# EAGLE design 2pix (EAGLE 6.5.0)
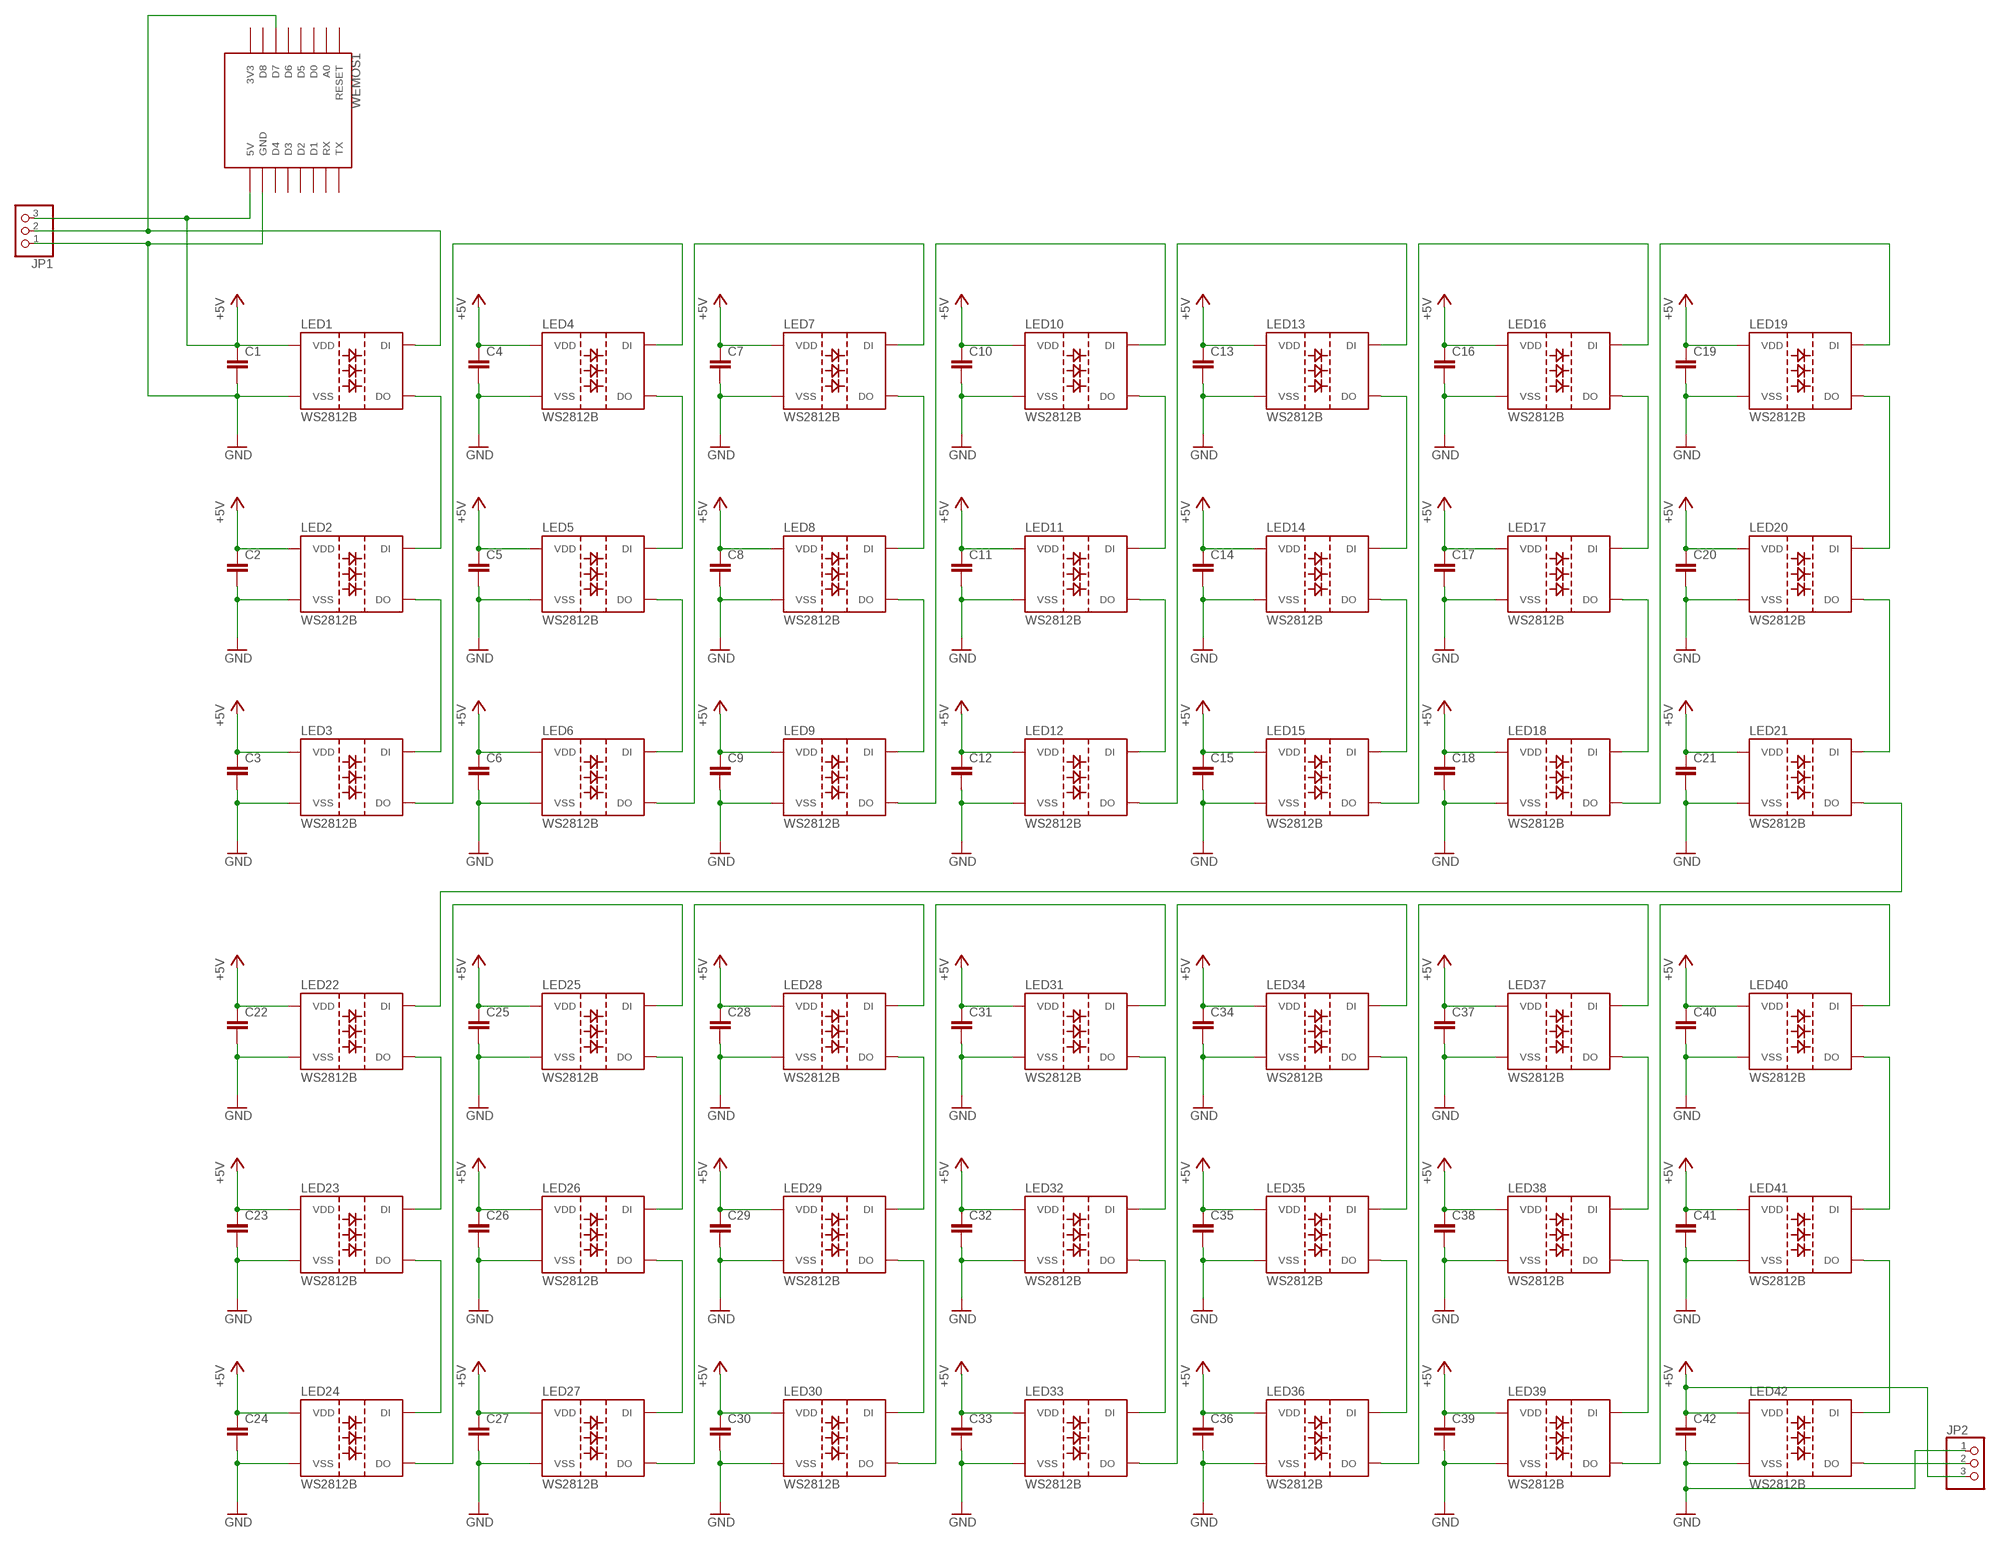
[diagram p0: schematic, sheet 1]

## Parts
C1  C-EUC1206  [C1206]
C2  C-EUC1206  [C1206]
C3  C-EUC1206  [C1206]
C4  C-EUC1206  [C1206]
C5  C-EUC1206  [C1206]
C6  C-EUC1206  [C1206]
C7  C-EUC1206  [C1206]
C8  C-EUC1206  [C1206]
C9  C-EUC1206  [C1206]
C10  C-EUC1206  [C1206]
C11  C-EUC1206  [C1206]
C12  C-EUC1206  [C1206]
C13  C-EUC1206  [C1206]
C14  C-EUC1206  [C1206]
C15  C-EUC1206  [C1206]
C16  C-EUC1206  [C1206]
C17  C-EUC1206  [C1206]
C18  C-EUC1206  [C1206]
C19  C-EUC1206  [C1206]
C20  C-EUC1206  [C1206]
C21  C-EUC1206  [C1206]
C22  C-EUC1206  [C1206]
C23  C-EUC1206  [C1206]
C24  C-EUC1206  [C1206]
C25  C-EUC1206  [C1206]
C26  C-EUC1206  [C1206]
C27  C-EUC1206  [C1206]
C28  C-EUC1206  [C1206]
C29  C-EUC1206  [C1206]
C30  C-EUC1206  [C1206]
C31  C-EUC1206  [C1206]
C32  C-EUC1206  [C1206]
C33  C-EUC1206  [C1206]
C34  C-EUC1206  [C1206]
C35  C-EUC1206  [C1206]
C36  C-EUC1206  [C1206]
C37  C-EUC1206  [C1206]
C38  C-EUC1206  [C1206]
C39  C-EUC1206  [C1206]
C40  C-EUC1206  [C1206]
C41  C-EUC1206  [C1206]
C42  C-EUC1206  [C1206]
JP1  PINHD-1X3  [1X03]
JP2  PINHD-1X3  [1X03]
LED1  WS2812B  [WS2812B]
LED2  WS2812B  [WS2812B]
LED3  WS2812B  [WS2812B]
LED4  WS2812B  [WS2812B]
LED5  WS2812B  [WS2812B]
LED6  WS2812B  [WS2812B]
LED7  WS2812B  [WS2812B]
LED8  WS2812B  [WS2812B]
LED9  WS2812B  [WS2812B]
LED10  WS2812B  [WS2812B]
LED11  WS2812B  [WS2812B]
LED12  WS2812B  [WS2812B]
LED13  WS2812B  [WS2812B]
LED14  WS2812B  [WS2812B]
LED15  WS2812B  [WS2812B]
LED16  WS2812B  [WS2812B]
LED17  WS2812B  [WS2812B]
LED18  WS2812B  [WS2812B]
LED19  WS2812B  [WS2812B]
LED20  WS2812B  [WS2812B]
LED21  WS2812B  [WS2812B]
LED22  WS2812B  [WS2812B]
LED23  WS2812B  [WS2812B]
LED24  WS2812B  [WS2812B]
LED25  WS2812B  [WS2812B]
LED26  WS2812B  [WS2812B]
LED27  WS2812B  [WS2812B]
LED28  WS2812B  [WS2812B]
LED29  WS2812B  [WS2812B]
LED30  WS2812B  [WS2812B]
LED31  WS2812B  [WS2812B]
LED32  WS2812B  [WS2812B]
LED33  WS2812B  [WS2812B]
LED34  WS2812B  [WS2812B]
LED35  WS2812B  [WS2812B]
LED36  WS2812B  [WS2812B]
LED37  WS2812B  [WS2812B]
LED38  WS2812B  [WS2812B]
LED39  WS2812B  [WS2812B]
LED40  WS2812B  [WS2812B]
LED41  WS2812B  [WS2812B]
LED42  WS2812B  [WS2812B]
WEMOS1  WEMOS-D1-MINI  [WEMOS-D1-MINI]

## Nets
+5V: C1.1 C2.1 C3.1 C4.1 C5.1 C6.1 C7.1 C8.1 C9.1 C10.1 C11.1 C12.1 C13.1 C14.1 C15.1 C16.1 C17.1 C18.1 C19.1 C20.1 C21.1 C22.1 C23.1 C24.1 C25.1 C26.1 C27.1 C28.1 C29.1 C30.1 C31.1 C32.1 C33.1 C34.1 C35.1 C36.1 C37.1 C38.1 C39.1 C40.1 C41.1 C42.1 JP1.3 JP2.3 LED1.1(VDD) LED2.1(VDD) LED3.1(VDD) LED4.1(VDD) LED5.1(VDD) LED6.1(VDD) LED7.1(VDD) LED8.1(VDD) LED9.1(VDD) LED10.1(VDD) LED11.1(VDD) LED12.1(VDD) LED13.1(VDD) LED14.1(VDD) LED15.1(VDD) LED16.1(VDD) LED17.1(VDD) LED18.1(VDD) LED19.1(VDD) LED20.1(VDD) LED21.1(VDD) LED22.1(VDD) LED23.1(VDD) LED24.1(VDD) LED25.1(VDD) LED26.1(VDD) LED27.1(VDD) LED28.1(VDD) LED29.1(VDD) LED30.1(VDD) LED31.1(VDD) LED32.1(VDD) LED33.1(VDD) LED34.1(VDD) LED35.1(VDD) LED36.1(VDD) LED37.1(VDD) LED38.1(VDD) LED39.1(VDD) LED40.1(VDD) LED41.1(VDD) LED42.1(VDD) WEMOS1.5V
GND: C1.2 C2.2 C3.2 C4.2 C5.2 C6.2 C7.2 C8.2 C9.2 C10.2 C11.2 C12.2 C13.2 C14.2 C15.2 C16.2 C17.2 C18.2 C19.2 C20.2 C21.2 C22.2 C23.2 C24.2 C25.2 C26.2 C27.2 C28.2 C29.2 C30.2 C31.2 C32.2 C33.2 C34.2 C35.2 C36.2 C37.2 C38.2 C39.2 C40.2 C41.2 C42.2 JP1.1 JP2.1 LED1.3(VSS) LED2.3(VSS) LED3.3(VSS) LED4.3(VSS) LED5.3(VSS) LED6.3(VSS) LED7.3(VSS) LED8.3(VSS) LED9.3(VSS) LED10.3(VSS) LED11.3(VSS) LED12.3(VSS) LED13.3(VSS) LED14.3(VSS) LED15.3(VSS) LED16.3(VSS) LED17.3(VSS) LED18.3(VSS) LED19.3(VSS) LED20.3(VSS) LED21.3(VSS) LED22.3(VSS) LED23.3(VSS) LED24.3(VSS) LED25.3(VSS) LED26.3(VSS) LED27.3(VSS) LED28.3(VSS) LED29.3(VSS) LED30.3(VSS) LED31.3(VSS) LED32.3(VSS) LED33.3(VSS) LED34.3(VSS) LED35.3(VSS) LED36.3(VSS) LED37.3(VSS) LED38.3(VSS) LED39.3(VSS) LED40.3(VSS) LED41.3(VSS) LED42.3(VSS) WEMOS1.GND
N$1: LED4.2(DO) LED5.4(DI)
N$2: LED1.2(DO) LED2.4(DI)
N$3: LED3.2(DO) LED4.4(DI)
N$4: LED2.2(DO) LED3.4(DI)
N$5: LED5.2(DO) LED6.4(DI)
N$6: LED6.2(DO) LED7.4(DI)
N$7: LED7.2(DO) LED8.4(DI)
N$8: LED9.2(DO) LED10.4(DI)
N$9: LED8.2(DO) LED9.4(DI)
N$10: LED10.2(DO) LED11.4(DI)
N$11: LED11.2(DO) LED12.4(DI)
N$12: LED12.2(DO) LED13.4(DI)
N$13: LED13.2(DO) LED14.4(DI)
N$14: LED15.2(DO) LED16.4(DI)
N$15: LED14.2(DO) LED15.4(DI)
N$16: LED16.2(DO) LED17.4(DI)
N$17: LED17.2(DO) LED18.4(DI)
N$18: LED18.2(DO) LED19.4(DI)
N$19: LED19.2(DO) LED20.4(DI)
N$20: LED21.2(DO) LED22.4(DI)
N$21: LED20.2(DO) LED21.4(DI)
N$22: LED22.2(DO) LED23.4(DI)
N$23: LED24.2(DO) LED25.4(DI)
N$24: LED23.2(DO) LED24.4(DI)
N$25: LED25.2(DO) LED26.4(DI)
N$26: LED26.2(DO) LED27.4(DI)
N$27: LED27.2(DO) LED28.4(DI)
N$28: LED28.2(DO) LED29.4(DI)
N$29: LED30.2(DO) LED31.4(DI)
N$30: LED29.2(DO) LED30.4(DI)
N$31: LED31.2(DO) LED32.4(DI)
N$32: LED32.2(DO) LED33.4(DI)
N$33: LED33.2(DO) LED34.4(DI)
N$34: LED34.2(DO) LED35.4(DI)
N$35: LED36.2(DO) LED37.4(DI)
N$36: LED35.2(DO) LED36.4(DI)
N$37: LED37.2(DO) LED38.4(DI)
N$38: LED38.2(DO) LED39.4(DI)
N$39: LED39.2(DO) LED40.4(DI)
N$40: LED40.2(DO) LED41.4(DI)
N$41: JP1.2 LED1.4(DI) WEMOS1.D7
N$42: LED41.2(DO) LED42.4(DI)
N$44: JP2.2 LED42.2(DO)
Unconnected: WEMOS1.3V3 WEMOS1.A0 WEMOS1.D0 WEMOS1.D1 WEMOS1.D2 WEMOS1.D3 WEMOS1.D4 WEMOS1.D5 WEMOS1.D6 WEMOS1.D8 WEMOS1.RESET WEMOS1.RX WEMOS1.TX

## Library data of the parts
C1-C42 = rcl:C-EU: CAPACITOR, European symbol
JP1 JP2 = pinhead:PINHD-1X3: PIN HEADER
LED1-LED42 = WS2812:WS2812B
WEMOS1 = esp8266modules:WEMOS-D1-MINI: WeMos.cc D1 mini ESP8266 module

## Board
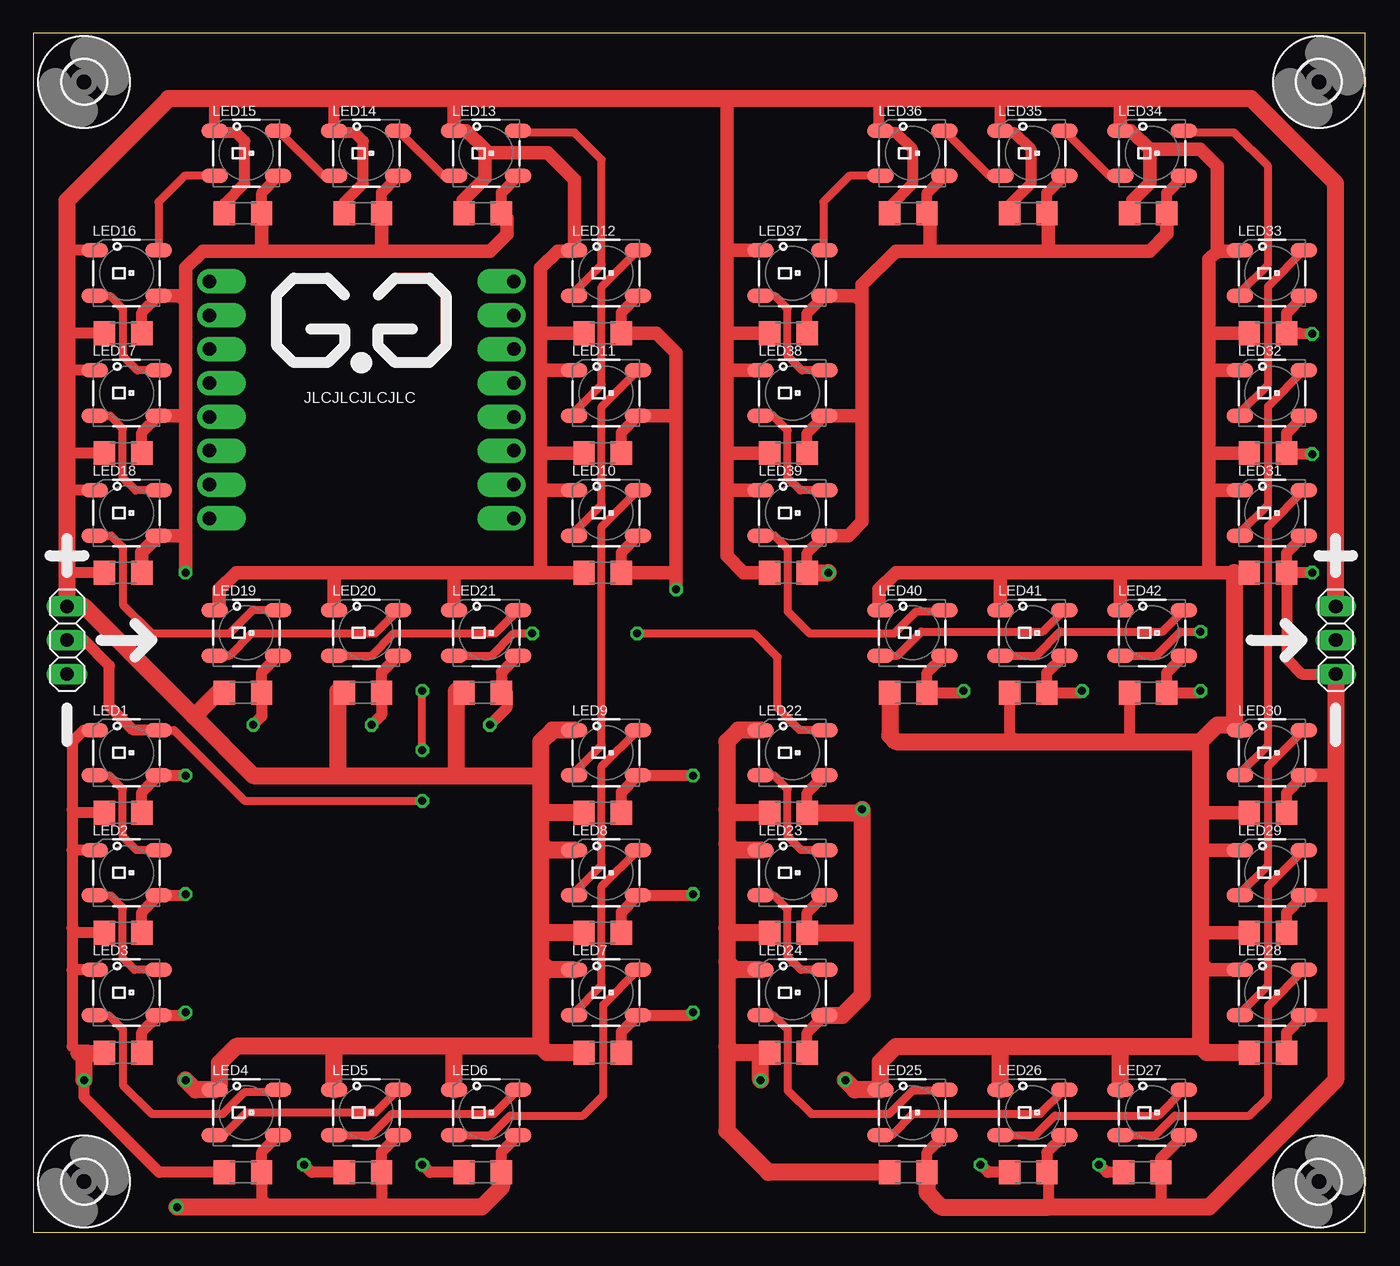
[diagram p1: board, top side]
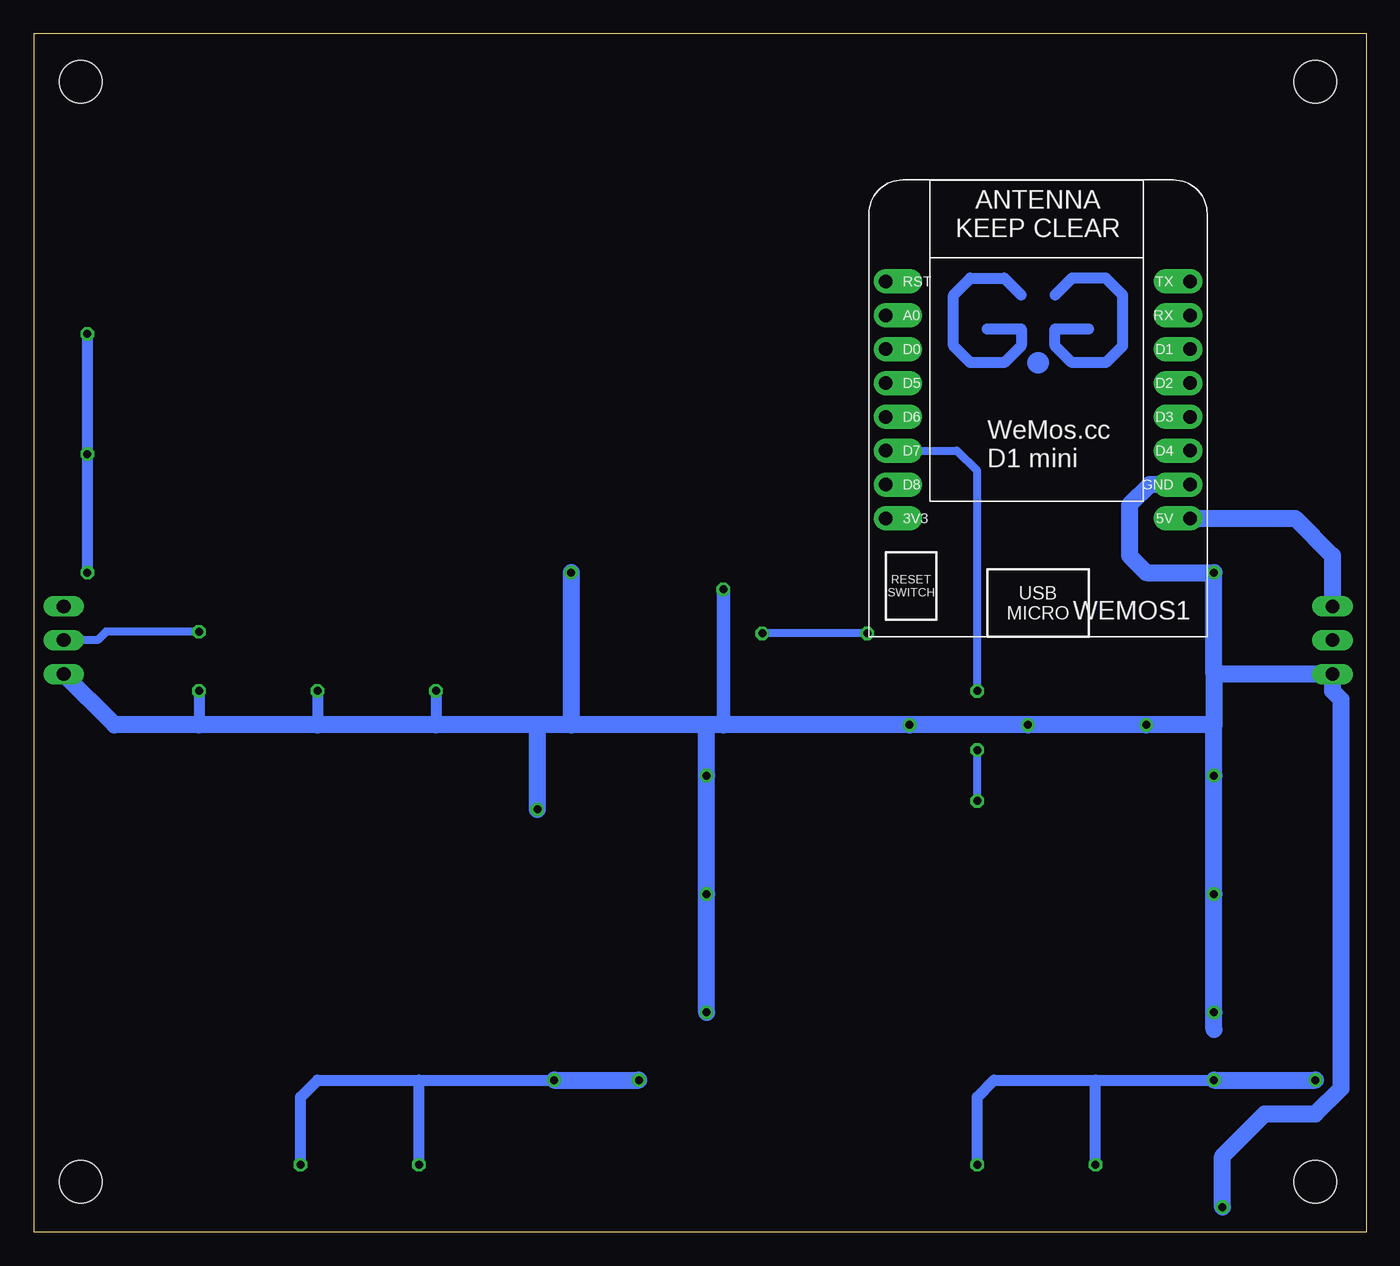
[diagram p2: board, bottom side, seen from below]

Size 100 x 90 mm. Coordinates in mm from the lower left corner, seen from the top.
Outline: 0,0 100,0 100,90 0,90 0,0
Copper layers (1*16): Top 0.035mm / dielectric 1.5mm / Bottom 0.035mm
Design rules "default": minimum track width 10mil, minimum drill 24mil, track to track 8mil, track to pad 8mil, pad to pad 8mil, via to via 8mil, smd to smd 8mil, copper to edge 40mil, drill to drill 8mil, minimum pad ring 10mil, minimum via ring 8mil, stop-mask expansion 4mil, vias tented up to drill 0mil, thermal gap 10mil

### Footprints (pad centres in the part's own frame; a part is rotated, then mirrored left to right if it is on the bottom)
C1206 = smd 1.6 x 1.8: 1 -1.4,0; 2 1.4,0
1X03 = drill 1.016 long: 1 -2.54,0; 2 0,0; 3 2.54,0
WS2812B = smd 2 x 1.1: 1 -2.4,1.7; 2 -2.4,-1.7; 3 2.4,-1.7; 4 2.4,1.7
3,2 = hole 3.2: 0,0
WEMOS-D1-MINI = drill 1.016 pad 1.829 offset: 3V3 -10.16,-10.16; 5V 12.7,-10.16; A0 -10.16,5.08; D0 -10.16,2.54; D1 12.7,2.54; D2 12.7,0; D3 12.7,-2.54; D4 12.7,-5.08; D5 -10.16,0; D6 -10.16,-2.54; D7 -10.16,-5.08; D8 -10.16,-7.62; GND 12.7,-7.62; RESET -10.16,7.62; RX 12.7,5.08; TX 12.7,7.62

### Placement (x,y rotation side)
C1  6.75,31.5 0 top
C2  6.75,22.5 0 top
C3  6.75,13.5 0 top
C4  15.75,4.5 0 top
C5  24.75,4.5 0 top
C6  33.75,4.5 0 top
C7  42.75,13.5 0 top
C8  42.75,22.5 0 top
C9  42.75,31.5 0 top
C10  42.75,49.5 0 top
C11  42.75,58.5 0 top
C12  42.75,67.5 0 top
C13  33.75,76.5 0 top
C14  24.75,76.5 0 top
C15  15.75,76.5 0 top
C16  6.75,67.5 0 top
C17  6.75,58.5 0 top
C18  6.75,49.5 0 top
C19  15.75,40.5 0 top
C20  24.75,40.5 0 top
C21  33.75,40.5 0 top
C22  56.7,31.5 0 top
C23  56.7,22.5 0 top
C24  56.7,13.5 0 top
C25  65.7,4.5 0 top
C26  74.7,4.5 0 top
C27  83.25,4.5 0 top
C28  92.7,13.5 0 top
C29  92.7,22.5 0 top
C30  92.7,31.5 0 top
C31  92.7,49.5 0 top
C32  92.7,58.5 0 top
C33  92.7,67.5 0 top
C34  83.7,76.5 0 top
C35  74.7,76.5 0 top
C36  65.7,76.5 0 top
C37  56.7,67.5 0 top
C38  56.7,58.5 0 top
C39  56.7,49.5 0 top
C40  65.7,40.5 0 top
C41  74.7,40.5 0 top
C42  83.7,40.5 0 top
JP1  2.54,44.45 90 top
JP2  97.79,44.45 90 top
LED1  7,36 0 top
LED2  7,27 0 top
LED3  7,18 0 top
LED4  16,9 0 top
LED5  25,9 0 top
LED6  34,9 0 top
LED7  43,18 0 top
LED8  43,27 0 top
LED9  43,36 0 top
LED10  43,54 0 top
LED11  43,63 0 top
LED12  43,72 0 top
LED13  34,81 0 top
LED14  25,81 0 top
LED15  16,81 0 top
LED16  7,72 0 top
LED17  7,63 0 top
LED18  7,54 0 top
LED19  16,45 0 top
LED20  25,45 0 top
LED21  34,45 0 top
LED22  57,36 0 top
LED23  57,27 0 top
LED24  57,18 0 top
LED25  66,9 0 top
LED26  75,9 0 top
LED27  84,9 0 top
LED28  93,18 0 top
LED29  93,27 0 top
LED30  93,36 0 top
LED31  93,54 0 top
LED32  93,63 0 top
LED33  93,72 0 top
LED34  84,81 0 top
LED35  75,81 0 top
LED36  66,81 0 top
LED37  57,72 0 top
LED38  57,63 0 top
LED39  57,54 0 top
LED40  66,45 0 top
LED41  75,45 0 top
LED42  84,45 0 top
U$1  [3,2]  3.81,86.36 0 top
U$2  [3,2]  96.52,86.36 0 top
U$3  [3,2]  96.52,3.81 0 top
U$4  [3,2]  3.81,3.81 0 top
WEMOS1  25.91,63.75 0 bottom

### Tracks (layer width: path | path; a pad name or v marks a point on that pad's centre or on a via)
+5V  (via drill 0.6)
  Top 0.813: C18.1 2.57,49.5 2.54,49.53 | C17.1 2.62,58.5 2.54,58.42 | LED18.1 2.72,55.7 2.54,55.88 | LED17.1 2.61,64.7 2.54,64.77 | C16.1 2.73,67.5 2.54,67.31 | LED16.1 2.58,73.7 2.54,73.66 | 13.97,85.09 13.6,84.72 LED15.1 13.75,82.55 15.24,82.55 15.88,81.92 15.88,78.74 14.35,77.22 C15.1 | C14.1 23.35,77.33 24.77,78.74 24.77,81.92 24.13,82.55 22.75,82.55 LED14.1 22.6,84.83 22.86,85.09 | 31.6,84.94 31.75,85.09 | C36.1 64.3,77 66.04,78.74 66.04,81.28 64.77,82.55 63.75,82.55 | 63.75,82.55 LED36.1 | C35.1 73.3,77.11 74.93,78.74 74.93,81.28 73.66,82.55 72.75,82.55 LED35.1 72.6,84.88 72.39,85.09 | 81.6,84.77 81.28,85.09 | 63.75,82.55 63.5,82.55 63.5,85.09 | 41.32,49.53 C10.1 | LED1.1 3.79,37.7 2.92,36.83 2.92,31.75 | 2.92,31.75 2.92,28.7 | 2.92,28.7 2.92,22.86 | 2.92,22.86 2.92,19.68 | 2.92,19.68 2.92,13.97 3.43,13.46 | LED3.1 2.94,19.7 2.92,19.68 | C2.1 3.28,22.5 2.92,22.86 | LED2.1 2.92,28.7 | C1.1 3.17,31.5 2.92,31.75 | C4.1 9.47,4.5 3.81,10.16 v3.81,11.43 | C5.1 20.9,4.5 v20.32,5.08 | C6.1 29.79,4.5 v29.21,5.08 | C26.1 71.7,4.5 v71.12,5.08 | C27.1 80.59,4.5 v80.01,5.08 | C42.1 82.3,37.08 82.55,36.83 | C41.1 73.3,37.19 73.66,36.83
  Top 1.016: 31.6,84.94 LED13.1 32.49,82.7 33.91,81.28 | 33.91,81.28 33.91,79.12 32.26,77.47 32.26,76.59 C13.1 | 40.56,73.66 LED12.1 | 38.1,67.31 38.1,64.77 | 38.1,64.77 38.1,58.42 | 38.1,58.42 38.1,55.88 | 38.1,55.88 38.1,49.53 | 38.1,49.53 31.75,49.53 | 31.75,49.53 22.86,49.53 | 22.86,49.53 15.24,49.53 13.97,48.26 13.97,47.07 LED19.1 | LED20.1 22.6,49.27 22.86,49.53 | LED21.1 31.6,49.38 31.75,49.53 | 41.32,49.53 38.1,49.53 | LED10.1 38.28,55.7 38.1,55.88 | C11.1 38.18,58.5 38.1,58.42 | LED11.1 38.17,64.7 38.1,64.77 | C12.1 38.29,67.5 38.1,67.31 | 81.6,84.77 LED34.1 82.4,82.7 83.82,81.28 | C34.1 82.3,76.45 82.55,76.2 82.55,77.47 83.82,78.74 83.82,81.28 | 88.27,67.31 88.27,64.77 | 88.27,64.77 88.27,58.42 | 88.27,58.42 88.27,55.88 | 88.27,55.88 88.27,49.53 | 88.27,49.53 90.17,49.53 91.27,49.53 C31.1 | 88.27,49.53 81.28,49.53 | 81.28,49.53 72.39,49.53 | 72.39,49.53 64.77,49.53 63.5,48.26 63.5,46.8 LED40.1 | LED41.1 72.6,49.32 72.39,49.53 | LED42.1 81.6,49.21 81.28,49.53 | C33.1 88.45,67.5 88.27,67.31 | LED31.1 88.44,55.7 88.27,55.88 | C32.1 88.34,58.5 88.27,58.42 | LED32.1 88.33,64.7 88.27,64.77 | 40.56,73.66 39.37,73.66 38.1,72.39 38.1,67.31 | 40.56,73.66 40.64,73.66 40.64,78.99 38.61,81.03 34.16,81.03 33.91,81.28 | LED28.1 88.25,19.7 87.63,20.32 | C29.1 87.99,22.5 87.63,22.86 | LED29.1 88.39,28.7 87.63,28.45 | C30.1 87.88,31.5 87.63,31.75 | 83.82,81.28 87.63,81.28 88.9,80.01 88.9,73.66 | 88.9,73.66 90.56,73.66 LED33.1 | 88.9,73.66 88.27,73.03 88.27,67.31 | 52.07,67.31 52.07,64.77 | 52.07,64.77 52.07,58.42 | 52.07,58.42 52.07,55.88 | 52.07,55.88 52.07,50.8 53.34,49.53 55.27,49.53 C39.1 | LED39.1 52.25,55.7 52.07,55.88 | C38.1 52.15,58.5 52.07,58.42
  Top 1.016: LED38.1 52.14,64.7 52.07,64.77 | C37.1 52.26,67.5 52.07,67.31 | 52.07,67.31 52.07,73.66 | 52.07,73.66 52.07,85.09 | LED37.1 52.11,73.7 52.07,73.66
  Top 1.27: JP2.3 97.79,78.74 91.44,85.09 81.28,85.09 72.39,85.09 63.5,85.09 52.07,85.09 31.75,85.09 22.86,85.09 13.97,85.09 10.16,85.09 2.54,77.47 2.54,73.66 2.54,67.31 2.54,64.77 2.54,58.42 2.54,55.88 2.54,49.53 JP1.3 3.81,46.99 12.06,38.73 | 12.06,38.73 16.51,34.29 22.86,34.29 | 22.86,34.29 31.75,34.29 | 31.75,34.29 38.1,34.29 | 38.1,34.29 38.1,31.75 | 38.1,31.75 38.1,29.21 | 38.1,29.21 38.1,22.86 | 38.1,22.86 38.1,20.32 | 38.1,20.32 38.1,13.97 | 38.1,13.97 31.75,13.97 | 31.75,13.97 22.86,13.97 | 22.86,13.97 15.24,13.97 13.97,12.7 13.97,11.07 LED4.1 12.16,10.7 v11.43,11.43 | LED5.1 22.6,13.71 22.86,13.97 | LED6.1 31.6,13.82 31.75,13.97 | C7.1 38.57,13.5 38.1,13.97 | LED7.1 38.72,19.7 38.1,20.32 | C8.1 38.46,22.5 38.1,22.86 | LED8.1 38.61,28.7 38.1,29.21 | C9.1 38.35,31.5 38.1,31.75 | LED9.1 38.97,37.7 38.1,36.83 38.1,34.29 | C21.1 31.89,40.5 31.75,40.64 31.75,34.29 | C20.1 23,40.5 22.86,40.64 22.86,34.29 | C19.1 13.83,40.5 12.06,38.73 | v3.81,11.43 3.81,13.21 4.06,13.46 | 4.06,13.46 5.31,13.46 C3.1 | 4.06,13.46 3.43,13.46 | LED22.1 52.94,37.7 52.07,36.83 52.07,31.75 | 52.07,31.75 52.07,29.21 | 52.07,29.21 52.07,22.86 | 52.07,22.86 52.07,20.32 | 52.07,20.32 52.07,13.97 | LED24.1 52.69,19.7 52.07,20.32 | C23.1 52.43,22.5 52.07,22.86 | LED23.1 52.58,28.7 52.07,29.21 | C22.1 52.32,31.5 52.07,31.75 | C24.1 54.61,13.5 | 54.61,13.5 52.54,13.5 52.07,13.97 | 52.07,13.97 52.07,7.62 55.19,4.5 C25.1 | C40.1 64.3,37.3 64.77,36.83 73.66,36.83 82.55,36.83 87.63,36.83 | 87.63,36.83 87.63,31.75 87.63,28.45 87.63,22.86 87.63,20.32 87.63,13.97 | C28.1 88.1,13.5 87.63,13.97 | 72.39,13.97 64.77,13.97 63.6,12.8 LED25.1 61.69,10.7 v60.96,11.43
  Top 1.27: 72.39,13.97 81.28,13.97 | 81.28,13.97 87.63,13.97 | LED27.1 81.6,13.65 81.28,13.97 | LED26.1 72.6,13.76 72.39,13.97 | v54.61,11.43 54.61,13.5 | 90.17,49.53 90.17,38.13 | 90.17,38.13 LED30.1 | 87.63,36.83 88.9,38.1 90.14,38.1 90.17,38.13
  Bottom 0.813: v20.32,5.08 20.32,11.43 | 20.32,11.43 v11.43,11.43 | v29.21,5.08 29.21,10.16 27.94,11.43 20.32,11.43 | v71.12,5.08 71.12,11.43 | 71.12,11.43 v60.96,11.43 | v80.01,5.08 80.01,10.16 78.74,11.43 71.12,11.43
  Bottom 1.27: v11.43,11.43 v3.81,11.43 | v60.96,11.43 v54.61,11.43 | WEMOS1.5V 5.33,53.59 2.54,50.8 JP1.3
GND  (via drill 0.6)
  Top 0.813: C16.2 8.15,69.05 LED16.3 | C17.2 8.15,60.05 LED17.3 | LED19.3 17.15,42.05 C19.2 17.15,38.74 v16.51,38.1 | LED20.3 26.15,42.05 C20.2 26.15,38.85 v25.4,38.1 | C21.2 35.15,41.05 | LED21.3 35.15,42.05 35.15,41.05 | C10.2 44.15,51.05 LED10.3 | C11.2 44.15,60.05 LED11.3 | C12.2 44.15,69.05 LED12.3 | C13.2 35.15,78.05 LED13.3 | C14.2 26.15,77.09 26.15,78.05 LED14.3 | C15.2 17.15,78.05 LED15.3 | C1.2 8.15,33.05 LED1.3 v11.42,34.3 v11.43,34.29 | C2.2 8.15,24.05 LED2.3 11.33,25.3 v11.43,25.4 | C3.2 8.15,15.05 LED3.3 11.22,16.3 v11.43,16.51 | LED4.3 17.15,6.05 C4.2 17.15,2.54 17.78,1.91 | LED5.3 26.15,6.05 C5.2 26.15,2.42 26.67,1.91 | C7.2 44.15,15.05 LED7.3 49.32,16.3 v49.53,16.51 | C8.2 44.15,24.05 LED8.3 49.43,25.3 v49.53,25.4 | C9.2 44.15,33.05 LED9.3 v49.52,34.3 v49.53,34.29 | C37.2 58.1,69 LED37.3 | C36.2 67.1,78 LED36.3 | C35.2 76.1,78 LED35.3 | C34.2 85.1,78 LED34.3 | LED33.3 94.1,69 C33.2 95.06,67.5 v96.01,67.44 | LED32.3 94.1,60 C32.2 94.18,58.42 v96.01,58.42 | C38.2 58.1,60 LED38.3 | C39.2 58.1,51 LED39.3 | C31.2 94.1,51 LED31.3 | LED40.3 67.1,42 C40.2 69.71,40.5 v69.85,40.64 | LED41.3 76.1,42 C41.2 78.6,40.5 v78.74,40.64 | LED42.3 85.1,42 C42.2 87.49,40.5 v87.63,40.64 | C30.2 94.1,33 LED30.3 | C22.2 58.1,33 LED22.3 | C23.2 58.1,24 LED23.3 | C29.2 94.1,24 LED29.3 | C28.2 94.1,15 LED28.3 | C24.2 58.1,15 LED24.3 | C26.2 76.1,5.18 | LED26.3 76.1,6 76.1,5.18 | LED27.3 84.65,5.55 C27.2 84.65,2.35 85.09,1.91 | 76.1,5.18 76.2,5.08 76.2,1.91 | C25.2 67.1,6 LED25.3 | 35.15,41.05 35.56,40.64 35.56,39.37 v34.29,38.1 | C6.2 35.15,6.05 LED6.3 | C31.2 94.1,43.06 95.25,41.91 JP2.1 | v96.01,49.53 94.13,49.53 C31.2
  Top 1.016: v11.43,49.53 11.43,52.07 | 11.43,52.07 11.43,60.96 | 11.43,60.96 11.43,69.85 | 11.43,69.85 11.43,72.39 12.7,73.66 17.14,73.66 | 17.14,73.66 26.29,73.66 | 26.29,73.66 34.29,73.66 35.56,74.93 35.56,76.09 C13.2 | C15.2 17.15,73.67 17.14,73.66 | 26.29,73.66 26.16,73.79 26.16,77.08 26.15,77.09 | LED16.3 10.98,70.3 11.43,69.85 | LED17.3 11.09,61.3 11.43,60.96 | 11.43,52.07 11.2,52.3 LED18.3 8.15,51.05 C18.2 | LED30.3 97.78,34.3 97.79,34.29 | LED29.3 97.69,25.3 97.79,25.4 | LED28.3 97.58,16.3 97.79,16.51 | LED39.3 61.19,52.3 62.23,53.34 62.23,60.96 | 62.23,60.96 62.23,69.85 | 62.23,69.85 62.23,71.12 64.77,73.66 67.31,73.66 | 67.31,73.66 76.2,73.66 | C34.2 85.1,74.94 83.82,73.66 76.2,73.66 | 67.31,73.66 67.31,76.29 C36.2 | 76.2,73.66 76.2,76.4 C35.2 | LED37.3 61.78,70.3 62.23,69.85 | LED38.3 61.89,61.3 62.23,60.96 | C12.2 46.8,67.5 48.26,66.04 48.26,60.96 | 48.26,60.96 48.26,49.53 | 48.26,49.53 44.18,49.53 C10.2 | LED11.3 47.92,61.3 48.26,60.96 | 48.26,49.53 v48.26,48.26
  Top 1.27: JP2.1 97.79,34.29 97.79,25.4 97.79,16.51 97.79,11.43 88.27,1.91 85.09,1.91 76.2,1.91 68.2,1.91 67.1,3 C25.2 | v10.79,1.91 17.78,1.91 26.67,1.91 33.66,1.91 35.15,3.4 C6.2 | C16.2 8.15,67.84 | C22.2 61.98,31.5 v62.23,31.75 62.23,22.86 | 62.23,22.86 62.23,17.78 60.75,16.3 LED24.3 | C23.2 61.87,22.5 62.23,22.86 | C39.2 59.66,49.5 v59.69,49.53
  Bottom 0.813: v69.85,40.64 69.85,38.1 | v78.74,40.64 78.74,38.1 | v87.63,40.64 87.63,38.1 | v96.01,67.44 v96.01,58.42 v96.01,49.53
  Bottom 1.016: v48.26,48.26 48.26,38.1
  Bottom 1.27: 11.43,41.91 JP1.1 2.54,40.64 1.91,40.01 1.91,10.79 3.81,8.89 7.62,8.89 10.79,5.71 v10.79,1.91 | 11.43,41.91 11.43,38.1 | 11.43,15.24 v11.43,16.51 v11.43,25.4 v11.43,34.29 11.43,38.1 | 11.43,38.1 v16.51,38.1 v25.4,38.1 v34.29,38.1 48.26,38.1 49.53,38.1 | v49.53,16.51 v49.53,25.4 v49.53,34.29 49.53,38.1 | 49.53,38.1 59.69,38.1 | 59.69,38.1 62.23,38.1 | 62.23,38.1 69.85,38.1 78.74,38.1 87.63,38.1 93.98,38.1 JP2.1 | 11.43,41.91 v11.43,49.53 16.51,49.53 17.78,50.8 17.78,54.61 16.26,56.13 WEMOS1.GND | v62.23,31.75 62.23,38.1 | v59.69,49.53 59.69,38.1
N$1
  Top 0.61: LED4.2 14.29,7.3 16,9.02 25.72,9.02 LED5.4
N$2
  Top 0.61: LED1.2 5.71,34.3 6.73,33.27 6.73,29.72 7.75,28.7 LED2.4
N$3
  Top 0.61: LED3.2 5.67,16.3 6.73,15.24 6.73,11.05 8.89,8.89 14.22,8.89 15.88,10.54 18.24,10.54 LED4.4
N$4
  Top 0.61: LED2.2 5.82,25.3 6.73,24.38 6.73,20.57 7.61,19.7 LED3.4
N$5
  Top 0.61: LED5.2 25.33,7.3 26.92,8.89 34.59,8.89 LED6.4
N$6
  Top 0.61: LED6.2 34.35,7.3 35.81,8.76 41.27,8.76 42.8,10.29 42.8,17.1 LED7.4
N$7
  Top 0.61: LED7.2 40.6,16.47 42.67,18.54 42.67,25.97 LED8.4
N$8
  Top 0.61: LED9.2 40.6,34.5 42.67,36.58 42.67,52.97 LED10.4
N$9
  Top 0.61: LED8.2 40.6,25.49 42.67,27.56 42.67,34.97 LED9.4
N$10
  Top 0.61: LED10.2 40.6,52.54 42.67,54.61 42.67,61.97 LED11.4
N$11
  Top 0.61: LED11.2 40.6,61.55 42.67,63.63 42.67,70.97 LED12.4
N$12
  Top 0.61: LED12.2 40.6,70.57 42.67,72.64 42.67,80.52 40.64,82.55 36.55,82.55 LED13.4
N$13
  Top 0.61: LED13.2 30.8,79.3 LED14.4
N$14
  Top 0.61: LED15.2 11.36,79.3 9.4,77.34 LED16.4
N$15
  Top 0.61: LED14.2 21.8,79.3 LED15.4
N$16
  Top 0.61: LED17.4 7.82,64.7 6.73,65.79 6.73,69.34 5.77,70.3 LED16.2
N$17
  Top 0.61: LED17.2 5.76,61.3 6.73,60.33 6.73,56.64 7.67,55.7 LED18.4
N$18
  Top 0.61: LED18.2 5.87,52.3 6.73,51.44 6.73,47.12 8.89,44.96 14.73,44.96 16.51,46.74 18.36,46.74 LED19.4
N$19
  Top 0.61: LED19.2 14.72,43.3 16.38,44.96 25.66,44.96 LED20.4
N$20  (via drill 0.6)
  Top 0.61: LED21.2 34.41,43.3 36.07,44.96 v37.47,44.96 | v45.34,44.96 54.1,44.96 55.88,43.18 55.88,39.37 57.55,37.7 LED22.4
  Bottom 0.61: v37.47,44.96 v45.34,44.96
N$21
  Top 0.61: LED20.2 25.39,43.3 27.05,44.96 34.66,44.96 LED21.4
N$22
  Top 0.61: LED22.2 55.62,34.3 56.64,33.27 56.64,29.72 57.66,28.7 LED23.4
N$23
  Top 0.61: LED24.2 55.58,16.3 56.64,15.24 56.64,10.67 58.42,8.89 64.26,8.89 66.04,10.67 68.37,10.67 LED25.4
N$24
  Top 0.61: LED23.2 55.6,25.3 56.64,24.26 56.64,20.7 57.64,19.7 LED24.4
N$25
  Top 0.61: LED25.2 64.45,7.3 66.04,8.89 75.59,8.89 LED26.4
N$26
  Top 0.61: LED26.2 75.25,7.3 76.71,8.76 84.46,8.76 LED27.4
N$27
  Top 0.61: LED27.2 84.26,7.3 85.72,8.76 91.31,8.76 92.71,10.16 92.71,17.01 LED28.4
N$28
  Top 0.61: LED28.2 90.6,16.43 92.71,18.54 92.71,26.01 LED29.4
N$29
  Top 0.61: LED30.2 90.6,34.47 92.71,36.58 92.71,53.01 LED31.4
N$30
  Top 0.61: LED29.2 90.6,25.45 92.71,27.56 92.71,35.01 LED30.4
N$31
  Top 0.61: LED31.2 90.6,52.5 92.71,54.61 92.71,62.01 LED32.4
N$32
  Top 0.61: LED32.2 90.6,61.52 92.71,63.63 92.71,71.01 LED33.4
N$33
  Top 0.61: LED33.2 90.6,70.53 92.71,72.64 92.71,80.01 90.17,82.55 86.55,82.55 LED34.4
N$34
  Top 0.61: LED34.2 80.8,79.3 LED35.4
N$35
  Top 0.61: LED36.2 61.27,79.3 59.31,77.34 59.31,73.79 LED37.4
N$36
  Top 0.61: LED35.2 71.8,79.3 LED36.4
N$37
  Top 0.61: LED37.2 55.68,70.3 56.64,69.34 56.64,65.79 57.73,64.7 LED38.4
N$38
  Top 0.61: LED38.2 55.54,61.3 56.64,60.2 56.64,56.64 57.58,55.7 LED39.4
N$39
  Top 0.61: LED39.2 55.65,52.3 56.64,51.31 56.64,46.61 58.29,44.96 64.64,44.96 66.29,46.61 68.31,46.61 LED40.4
N$40
  Top 0.61: LED40.2 64.89,43.3 66.67,45.09 75.78,45.09 LED41.4
N$41  (via drill 0.6)
  Top 0.61: LED1.4 10.56,37.7 15.88,32.38 v29.21,32.38 | v29.21,36.2 v29.21,40.64
  Top 0.813: JP1.2 3.81,44.45 5.71,42.55 5.71,39.5 7.51,37.7 LED1.4
  Bottom 0.61: v29.21,32.38 v29.21,36.2 | v29.21,40.64 29.21,57.15 30.73,58.67 WEMOS1.D7
N$42
  Top 0.61: LED41.2 75.3,43.3 77.09,45.09 84.78,45.09 LED42.4
N$44  (via drill 0.6)
  Top 0.61: LED42.2 84.32,43.3 86.11,45.09 v87.63,45.09
  Bottom 0.61: v87.63,45.09 94.61,45.09 95.25,44.45 JP2.2
S$1
  Bottom 0.813: 20.83,67.82 23.37,67.82 23.37,66.55 22.1,65.28 19.56,65.28 18.29,66.55 18.29,70.36 19.56,71.63 22.1,71.63 23.37,70.36
S$2
  Bottom 0.813: 28.45,67.82 25.91,67.82 25.91,66.55 27.18,65.28 29.72,65.28 30.99,66.55 30.99,70.36 29.72,71.63 27.18,71.63 25.91,70.36
S$3
  Top 0.813: 28.45,67.82 25.91,67.82 25.91,66.55 27.18,65.28 29.72,65.28 30.99,66.55 30.99,70.36 29.72,71.63 27.18,71.63 25.91,70.36
S$4
  Top 0.813: 20.83,67.82 23.37,67.82 23.37,66.55 22.1,65.28 19.56,65.28 18.29,66.55 18.29,70.36 19.56,71.63 22.1,71.63 23.37,70.36
(copper drawn outside any net)
  shapes: Bottom circle x1, Top circle x1

### Text on the board
tNames: JLCJLCJLCJLC